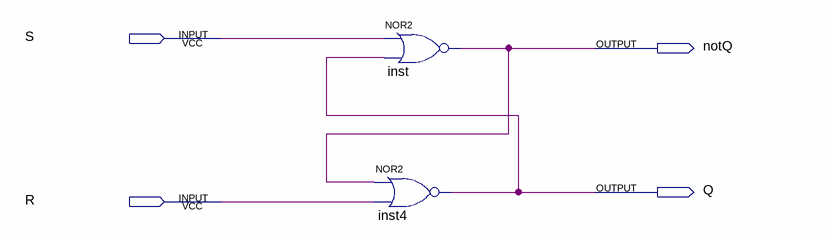
[diagram p0: schematic sheet]
// Quartus schematic SR_Latch.bdf as structural Verilog: 2 symbols, 4 pins
module SR_Latch (
  input  S,
  input  R,
  output notQ,
  output Q
);

  nor inst (notQ, S, Q);
  nor inst4 (Q, notQ, R);
endmodule
